# Altium schematic sheet LEDRing.SchDoc
size A4
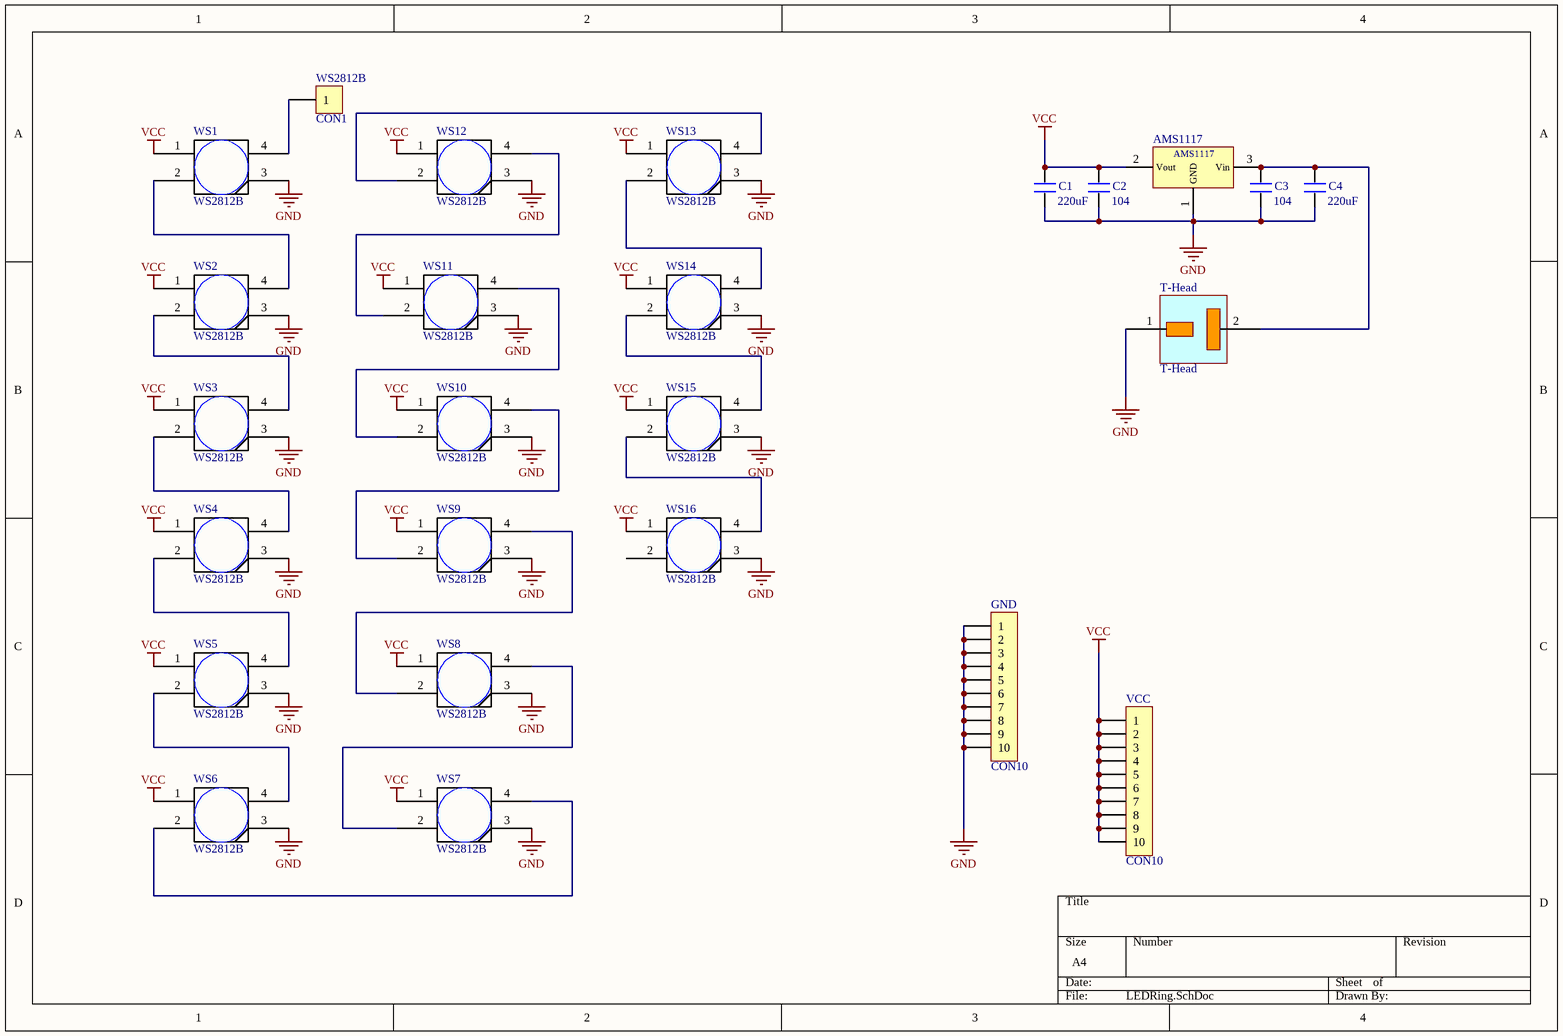
[diagram p0: LEDRing.SchDoc]

## Parts
AMS1117  AMS1117  [AMS1117-3.3]  (value not drawn)
C1  220uF  [0805]
C2  104  [0805]
C3  104  [0805]
C4  220uF  [0805]
GND  CON10  [HDR1X10]
T-Head  T-Head  [T_head]
VCC  CON10  [HDR1X10]
WS1  WS2812B  [WS2812B]
WS2  WS2812B  [WS2812B]
WS3  WS2812B  [WS2812B]
WS4  WS2812B  [WS2812B]
WS5  WS2812B  [WS2812B]
WS6  WS2812B  [WS2812B]
WS7  WS2812B  [WS2812B]
WS8  WS2812B  [WS2812B]
WS9  WS2812B  [WS2812B]
WS10  WS2812B  [WS2812B]
WS11  WS2812B  [WS2812B]
WS12  WS2812B  [WS2812B]
WS13  WS2812B  [WS2812B]
WS14  WS2812B  [WS2812B]
WS15  WS2812B  [WS2812B]
WS16  WS2812B  [WS2812B]
WS2812B  CON1  [PIN1]

## Nets
GND: AMS1117.1(GND) C1.1 C2.1 C3.1 C4.1 GND.1 GND.2 GND.3 GND.4 GND.5 GND.6 GND.7 GND.8 GND.9 GND.10 T-Head.1(GND) WS1.3(GND) WS2.3(GND) WS3.3(GND) WS4.3(GND) WS5.3(GND) WS6.3(GND) WS7.3(GND) WS8.3(GND) WS9.3(GND) WS10.3(GND) WS11.3(GND) WS12.3(GND) WS13.3(GND) WS14.3(GND) WS15.3(GND) WS16.3(GND)
VCC: AMS1117.2(Vout) C1.2 C2.2 VCC.1 VCC.2 VCC.3 VCC.4 VCC.5 VCC.6 VCC.7 VCC.8 VCC.9 VCC.10 WS1.1(VDD) WS2.1(VDD) WS3.1(VDD) WS4.1(VDD) WS5.1(VDD) WS6.1(VDD) WS7.1(VDD) WS8.1(VDD) WS9.1(VDD) WS10.1(VDD) WS11.1(VDD) WS12.1(VDD) WS13.1(VDD) WS14.1(VDD) WS15.1(VDD) WS16.1(VDD)
NetAMS1117_3: AMS1117.3(Vin) C3.2 C4.2 T-Head.2(VCC)
NetWS1_2: WS1.2(DOUT) WS2.4(DIN)
NetWS1_4: WS1.4(DIN) WS2812B.1
NetWS2_2: WS2.2(DOUT) WS3.4(DIN)
NetWS3_2: WS3.2(DOUT) WS4.4(DIN)
NetWS4_2: WS4.2(DOUT) WS5.4(DIN)
NetWS5_2: WS5.2(DOUT) WS6.4(DIN)
NetWS6_2: WS6.2(DOUT) WS7.4(DIN)
NetWS7_2: WS7.2(DOUT) WS8.4(DIN)
NetWS8_2: WS8.2(DOUT) WS9.4(DIN)
NetWS9_2: WS9.2(DOUT) WS10.4(DIN)
NetWS10_2: WS10.2(DOUT) WS11.4(DIN)
NetWS11_2: WS11.2(DOUT) WS12.4(DIN)
NetWS12_2: WS12.2(DOUT) WS13.4(DIN)
NetWS13_2: WS13.2(DOUT) WS14.4(DIN)
NetWS14_2: WS14.2(DOUT) WS15.4(DIN)
NetWS15_2: WS15.2(DOUT) WS16.4(DIN)

Not connected (* = marked no-connect by the designer): WS16 2(DOUT)

## Library data of the parts
C1-C4 = C
T-Head = T-Head: pin to pad: 1>2 2>1
WS1-WS16 = Component_1